# Altium schematic sheet Led_Button.SchDoc
size A4; SheetNumber: 8; SheetTotal: 7
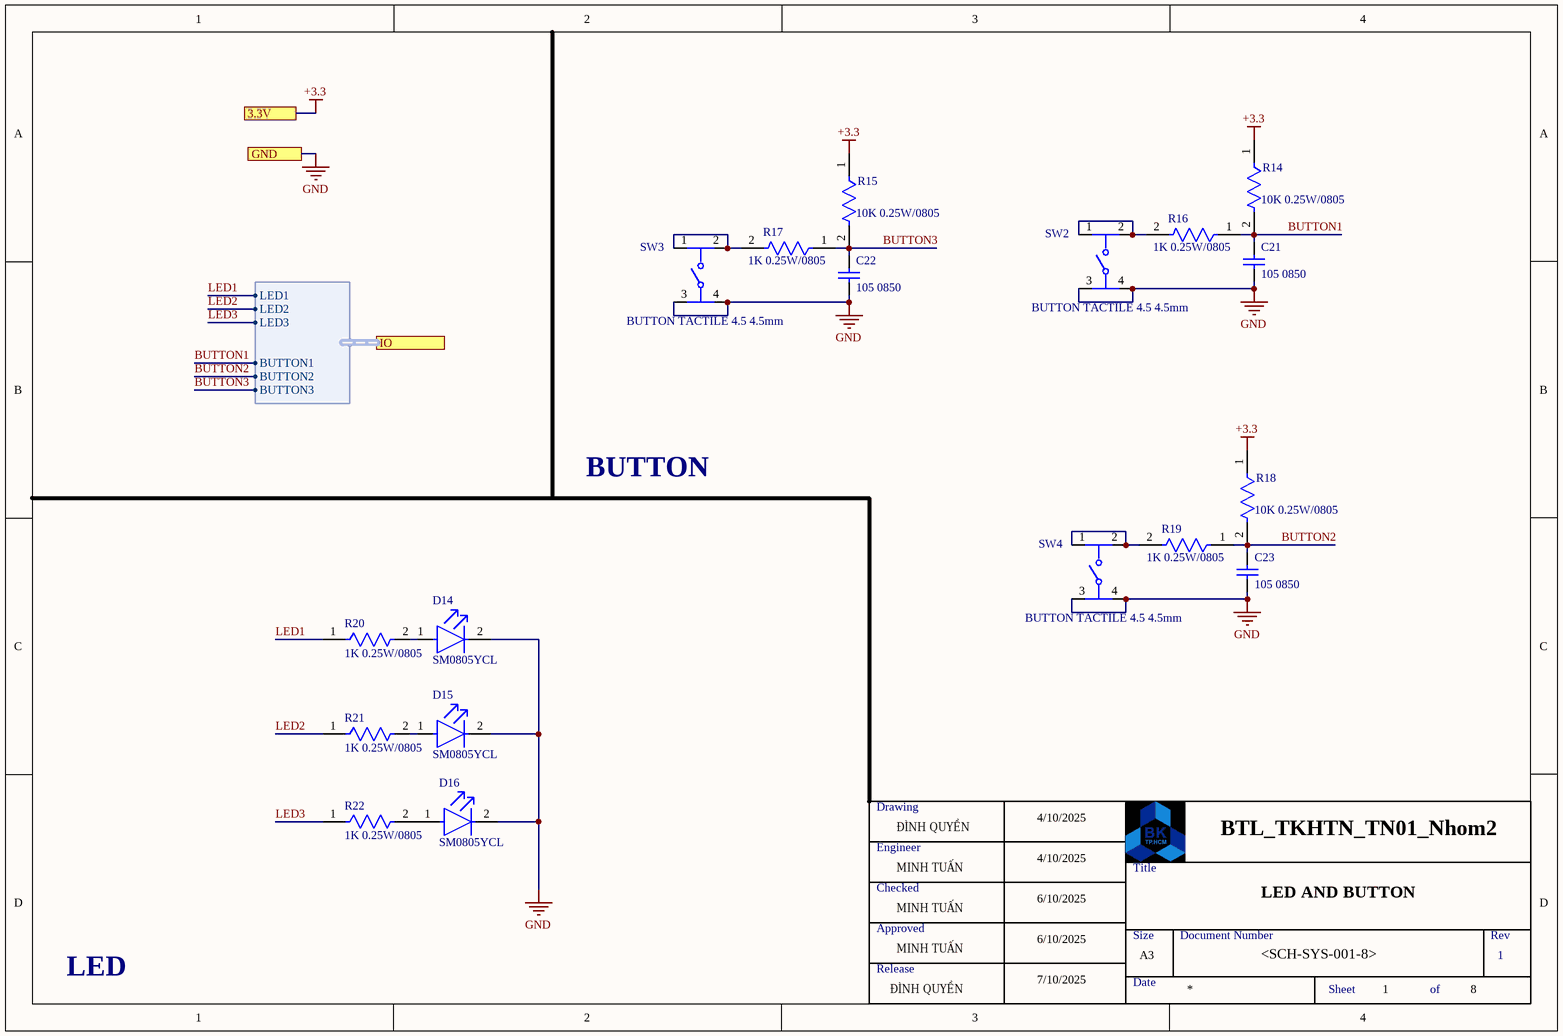
[diagram p0: Led_Button.SchDoc]

## Parts
C21  105 0850  [CAPC0805(2012)145_M]
C22  105 0850  [CAPC0805(2012)145_M]
C23  105 0850  [CAPC0805(2012)145_M]
D14  SM0805YCL  [FP-SM0805YCL-MFG]
D15  SM0805YCL  [FP-SM0805YCL-MFG]
D16  SM0805YCL  [FP-SM0805YCL-MFG]
R14  10K 0.25W/0805  [FP-AF0805-IPC_C]
R15  10K 0.25W/0805  [FP-AF0805-IPC_C]
R16  1K 0.25W/0805  [FP-AF0805-IPC_C]
R17  1K 0.25W/0805  [FP-AF0805-IPC_C]
R18  10K 0.25W/0805  [FP-AF0805-IPC_C]
R19  1K 0.25W/0805  [FP-AF0805-IPC_C]
R20  1K 0.25W/0805  [FP-AF0805-IPC_C]
R21  1K 0.25W/0805  [FP-AF0805-IPC_C]
R22  1K 0.25W/0805  [FP-AF0805-IPC_C]
SW2  BUTTON TACTILE 4.5 4.5mm  [FP-PTS647SK38SMTR2LFS-MFG]
SW3  BUTTON TACTILE 4.5 4.5mm  [FP-PTS647SK38SMTR2LFS-MFG]
SW4  BUTTON TACTILE 4.5 4.5mm  [FP-PTS647SK38SMTR2LFS-MFG]

## Ports
3.3V (see DC_MOTOR_CONTROLLER[2B], 78M05_RT9193[2A], Microcontroller[1A], UART_CH340G[1A]), GND (see DC_MOTOR_CONTROLLER[2C], 78M05_RT9193[2A], L298N_Motor[1C], Microcontroller[1A], UART_CH340G[1A]), IO (harness LED_BUTTON, see DC_MOTOR_CONTROLLER[2B], Microcontroller[1D])

## Harnesses
LED_BUTTON: LED1, LED2, BUTTON1, BUTTON2, BUTTON3, LED3

## Nets
+3.3: R14.1 R15.1 R18.1 ; port 3.3V
GND: C21.1 C22.1 C23.1 D14.2(C) D15.2(C) D16.2(C) SW2.3 SW2.4 SW3.3 SW3.4 SW4.3 SW4.4 ; port GND
BUTTON1: C21.2 R14.2 R16.1 ; port IO.BUTTON1
BUTTON2: C23.2 R18.2 R19.1 ; port IO.BUTTON2
BUTTON3: C22.2 R15.2 R17.1 ; port IO.BUTTON3
LED1: R20.1 ; port IO.LED1
LED2: R21.1 ; port IO.LED2
LED3: R22.1 ; port IO.LED3
NetD14_1: D14.1(A) R20.2
NetD15_1: D15.1(A) R21.2
NetD16_1: D16.1(A) R22.2
NetR16_2: R16.2 SW2.1 SW2.2
NetR17_2: R17.2 SW3.1 SW3.2
NetR19_2: R19.2 SW4.1 SW4.2

## Notes on the sheet
- BUTTON
- Drawing
- Engineer
- ĐÌNH QUYỀN
- 4/10/2025
- BTL_TKHTN_TN01_Nhom2
- Checked
- MINH TUẤN
- 6/10/2025
- Title
- LED AND BUTTON
- LED
- Approved
- Release
- 7/10/2025
- Size
- Date
- A3
- Document Number
- <SCH-SYS-001-8>
- Rev
- 1
- Sheet
- of
- 8

## Library data of the parts
C21-C23 = CMP-1036-03968-1: CAP 15nF 100V ±10% 0805 (2012 Metric) Thickness 1.45mm SMD; Tolerance: Â±10%; Case-Metric: 2012; Case-EIA: 0805; Rated Voltage: 100 V; Max Thickness: 1.45 mm; Technology: SMT; Value: 15nF
D14-D16 = CMP-35283-000007-1: LED YELLOW CLEAR 0805 SMD; Luminous Intensity: 11.5mcd; Test Current: 2mA; Viewing Angle: 130°; Dominant Wavelength: 592nm; Forward Voltage: 1.9V; Lens Color: Colorless; Case Code (Metric): 2012; Illumination Color: Yellow; Length: 2mm; Max Operating Temperature: 80°C; Width: 1.2mm; Case Code (Imperial): 0805; Packaging: Tape and Reel; Lens Transparency: Clear; Mount: Surface Mount; Case/Package: 0805; Forward Current: 2mA; Height: 0.8mm; Lead Free: Lead Free; Min Operating Temperature: -30°C; Color: Yellow; Package Quantity: 4000
R14-R22 = CMP-03412-045285-1: Anti-Sulfurated Chip Resistor Automotive Grade 75Ω 1% 0.125W ±100ppm/°C 0805; Max Power Dissipation: 125mW; Resistance: 75R; Resistor Type: Thick Film; Number of Terminations: 2; Min Operating Temperature: -55°C; Packaging: Tape and Reel; Height: 0.024inch; Max Operating Temperature: 155°C; Series: AF; Case/Package: 0805; Tolerance: 1%; Length: 0.079inch; Width: 0.049inch; Features: Moisture Resistant; RoHS Compliant: Yes; Temperature Coefficient: 100ppm/°C
SW2-SW4 = CMP-10040-000033-1: TACT 4.5 X 4.5, 3.8 MM H, 2.5N,; Switch Function: Off-Mom; Switch Travel: 0.25mm; Actuator Type: Standard; Illumination Type: Non-Illuminated; Mechanical Life: 100000Cycles; Ratings: IP40; Operating Force: 250gf; Throw Configuration: SPST; Max Operating Temperature: 70°C; Min Operating Temperature: -20°C; Termination: Gull Wing; Mount: Surface Mount; Packaging: Tape and Reel